# Altium schematic sheet PCI_Express.SchDoc
size A3; PageSetup: Record=PageOptions|CenterHorizontal=True|CenterVertical=True|PrintScale=0.73|XCorrection=1.00|YCorrection=1.00|PrintKind=0|BorderSize=5000000|LeftOffset=0|BottomOffset=0|Orientation=2|PaperLength=1000|PaperWidth=1000|Scale=100|PaperSource=7|PrintQuality=-4|MediaType=1|DitherType=10|PaperKind=A4|PrintScaleMode=1; Date: 27.05.2014; DrawnBy: luths8; Organization: BFH; Address1: Bern University of Applied Sciences; Address2: Engineering and Information Technology; Address3: Jlcoweg 1; Address4: CH-3400 Burgdorf; DocumentNumber: 13; Revision: 1.0; SheetNumber: 13; SheetTotal: 16; CurrentDate: 27.05.2014
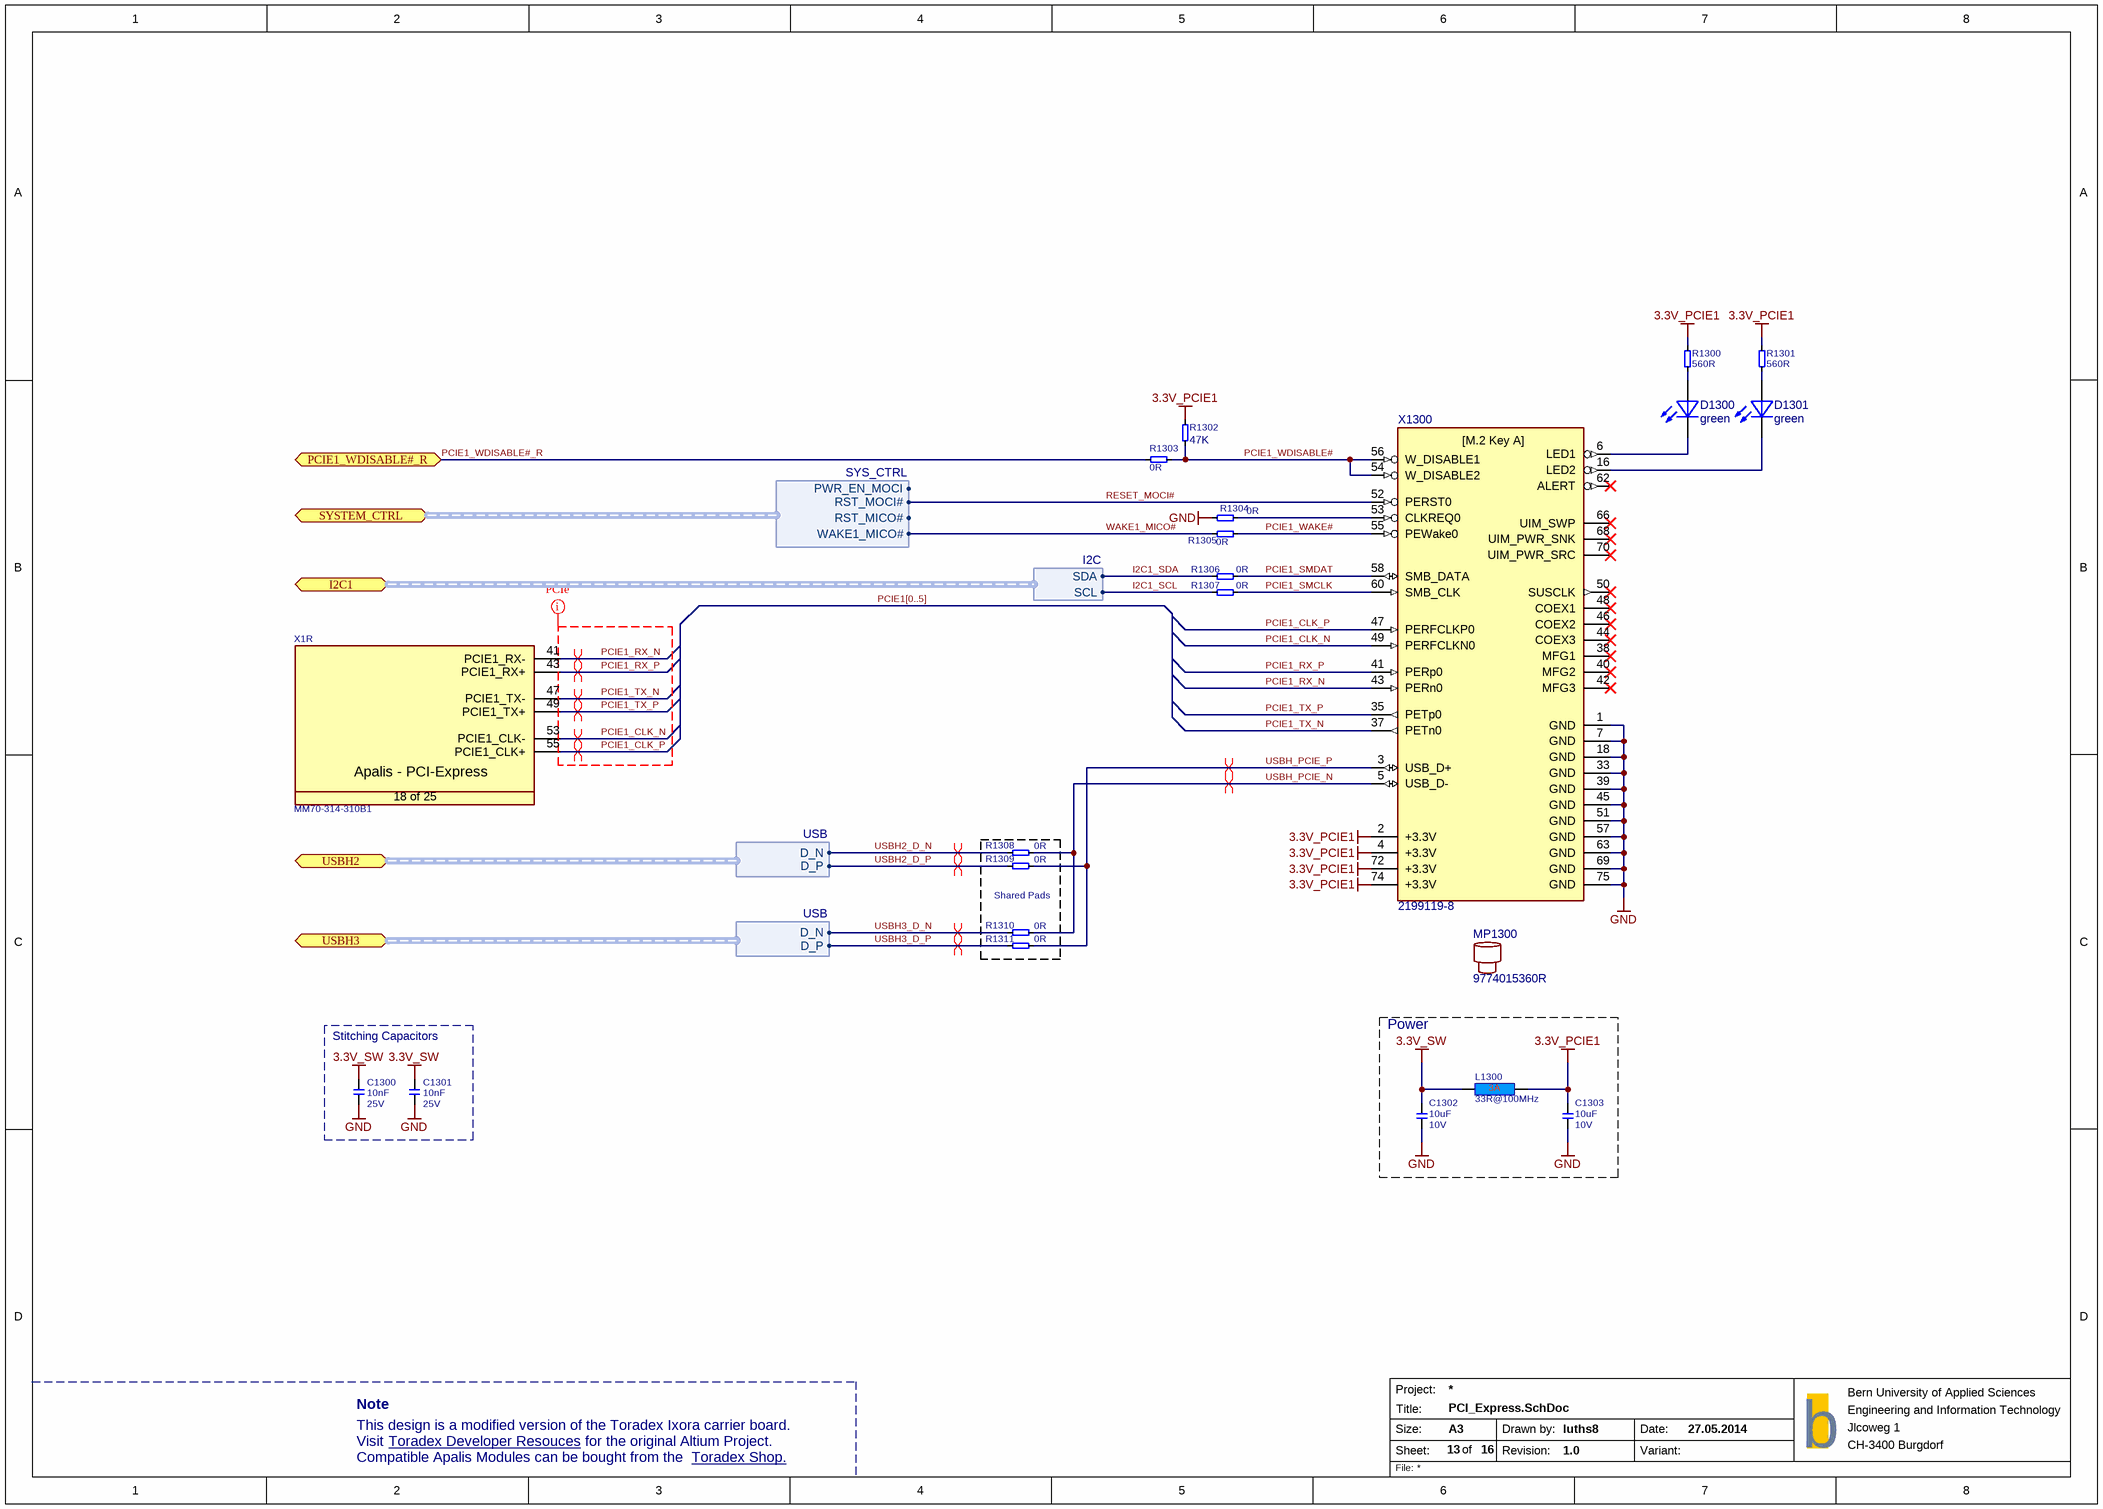
[diagram p0: PCI_Express.SchDoc]

## Parts
C1300  10nF  Rating: 25V  [SMD0603CAP]
C1301  10nF  Rating: 25V  [SMD0603CAP]
C1302  Rating: 10V  [SMD0603CAP]  (hidden comment: 10uF)
C1303  Rating: 10V  [SMD0603CAP]  (hidden comment: 10uF)
D1300  green  [LED]
D1301  green  [LED]
L1300  33R@100MHz  [INDC1608X95N]
MP1300  9774015360R
R1300  560R  [SMD0603RES]
R1301  560R  [SMD0603RES]
R1302  47K  [SMD0603RES]
R1303  0R  [SMD0603RES]
R1304  0R  [SMD0603RES]
R1305  0R  [SMD0603RES]
R1306  0R  [SMD0603RES]
R1307  0R  [SMD0603RES]
R1308  0R  [SMD0603RES]
R1309  0R  [SMD0603RES]
R1310  0R  [SMD0603RES]
R1311  0R  [SMD0603RES]
X1  Manufacturer Part No.: MM70-314-310B1  [T_JAE_MM70-314-310B1]  (hidden comment: CON-JAE-MM70-314-310B1-314-0.5mm)  (part R of 25)
X1300  2199119-8  [2199119-8-KEY-A-2230]

## Blocks framed on the sheet
Shared Pads: R1308-R1311
Stitching Capacitors: C1300 C1301
Power: C1302 C1303 L1300

## Ports
I2C1 (bidir, harness I2C, see 12, 17, 19, 5), PCIE1_WDISABLE#_R (bidir, see 19), SYSTEM_CTRL (bidir, harness SYS_CTRL, see 12, 19, 4), USBH2 (bidir, harness USB, see 6, 7), USBH3 (bidir, harness USB, see 6, 7)

## Harnesses
USB: D_N, D_P
I2C: SCL, SDA
SYS_CTRL: PWR_EN_MOCI, RST_MOCI#, RST_MICO#, WAKE1_MICO#

## Nets
3.3V_PCIE1: C1303.2 L1300.2 R1300.1 R1301.1 R1302.2 X1300.2(+3.3V) X1300.4(+3.3V) X1300.72(+3.3V) X1300.74(+3.3V)
3.3V_SW: C1300.2 C1301.2 C1302.2 L1300.1
GND: C1300.1 C1301.1 C1302.1 C1303.1 R1304.1 X1300.1(GND) X1300.7(GND) X1300.18(GND) X1300.33(GND) X1300.39(GND) X1300.45(GND) X1300.51(GND) X1300.57(GND) X1300.63(GND) X1300.69(GND) X1300.75(GND)
I2C1_SCL: R1307.1 ; port I2C1.SCL
I2C1_SDA: R1306.1 ; port I2C1.SDA
PCIE1_CLK_N: X1.53(PCIE1_CLK-) X1300.49(PERFCLKN0)
PCIE1_CLK_P: X1.55(PCIE1_CLK+) X1300.47(PERFCLKP0)
PCIE1_RX_N: X1.41(PCIE1_RX-) X1300.43(PERn0)
PCIE1_RX_P: X1.43(PCIE1_RX+) X1300.41(PERp0)
PCIE1_SMCLK: R1307.2 X1300.60(SMB_CLK)
PCIE1_SMDAT: R1306.2 X1300.58(SMB_DATA)
PCIE1_TX_N: X1.47(PCIE1_TX-) X1300.37(PETn0)
PCIE1_TX_P: X1.49(PCIE1_TX+) X1300.35(PETp0)
PCIE1_WAKE#: R1305.2 X1300.55(PEWake0)
PCIE1_WDISABLE#: R1302.1 R1303.1 X1300.54(W_DISABLE2) X1300.56(W_DISABLE1)
PCIE1_WDISABLE#_R: R1303.2 ; port PCIE1_WDISABLE#_R
RESET_MOCI#: X1300.52(PERST0) ; port SYSTEM_CTRL.RST_MOCI#
USBH2_D_N: R1308.1 ; port USBH2.D_N
USBH2_D_P: R1309.1 ; port USBH2.D_P
USBH3_D_N: R1310.1 ; port USBH3.D_N
USBH3_D_P: R1311.1 ; port USBH3.D_P
USBH_PCIE_N: R1308.2 R1310.2 X1300.5(USB_D-)
USBH_PCIE_P: R1309.2 R1311.2 X1300.3(USB_D+)
WAKE1_MICO#: R1305.1 ; port SYSTEM_CTRL.WAKE1_MICO#
NetD1300_A: D1300.A R1300.2
NetD1300_C: D1300.C X1300.6(LED1)
NetD1301_A: D1301.A R1301.2
NetD1301_C: D1301.C X1300.16(LED2)
NetR1304_2: R1304.2 X1300.53(CLKREQ0)

Not connected (* = marked no-connect by the designer): X1300 38(MFG1)* 40(MFG2)* 42(MFG3)* 44(COEX3)* 46(COEX2)* 48(COEX1)* 50(SUSCLK)* 62(ALERT)* 66(UIM_SWP)* 68(UIM_PWR_SNK)* 70(UIM_PWR_SRC)*

## Buses and harness runs
bus PCIE1[0..5]

## Layout directives
differential pair: PCIE1_CLK_N, PCIE1_CLK_P, PCIE1_RX_N, PCIE1_RX_P, PCIE1_TX_N, PCIE1_TX_P, USBH2_D_N, USBH2_D_P, USBH3_D_N, USBH3_D_P, USBH_PCIE_N, USBH_PCIE_P
net class PCIe: PCIE1_CLK_N, PCIE1_CLK_P, PCIE1_RX_N, PCIE1_RX_P, PCIE1_TX_N, PCIE1_TX_P

## Notes on the sheet
- Note
- This design is a modified version of the Toradex Ixora carrier board.
- Visit
- Compatible Apalis Modules can be bought from the
- Toradex Developer Resouces <https://developer.toradex.com/products/ixora-carrier-board>
- for the original Altium Project.
- Toradex Shop. <https://www.toradex.com/order-now/apalis-arm-family>
- Project:
- Size:
- Sheet:
- Title:
- A3
- of
- Drawn by:
- Revision:
- Date:
- Variant:
- b
- File:
- (in symbol CON-JAE-MM70-314-310B1-314-0.5mm, part R) Apalis - PCI-Express; 18 of 25
- (in symbol Connector M.2 Key A) [M.2 Key A]

## Library data of the parts
C1300 C1301 = C-X7R-10nF-25V-10%-0603: Capacitor Ceramic X7R 10nF 25V 10% 0603; Tolerance: 10%; Type: X7R; Value: 10nF
C1302 C1303 = C-X5R-10uF-10V-20%-0603: Capacitor Ceramic X5R 10uF 10V 20% 0603; Tolerance: 20%; Type: X5R; Value: 10uF
D1300 D1301 = LED green: Manufacturer Part No.: LGM67KG1J224Z
L1300 = L-33R@100MHz-3A-25%-0603: 33R@100MHz 3A EMI FILTER; Tolerance: 25%; Rating: 3A; Value: 33R@100MHz
MP1300 = Spacer M3 SMD: Manufacturer Part No.: 9774015360R
R1300 R1301 = R-560R-63mW-5%-0402: Resistor 560 ohm 63mW 5% 0603; Rating: 63mW; Tolerance: 5%; Value: 560R
R1302 = R-47KR-63mW-5%-0603: Resistor 47 Kohm 63mW 5% 0603; Value: 47KR; Rating: 63mW; Tolerance: 5%
R1303-R1305 R1308-R1311 = R-0R-63mW-1%-0603: Resistor 0 ohm 63mW 1% 0603; Rating: 63mW; Tolerance: 1%; Value: 0R
R1306 R1307 = R-0R-63mW-1%-0402: Resistor 0 ohm 63mW 1% 0603; Rating: 63mW; Tolerance: 1%; Value: 0R
X1 = CON-JAE-MM70-314-310B1-314-0.5mm: MXM3 Connector; Manufacturer Name: JAE; No. of ways: 314
X1300 = Connector M.2 Key A: Manufacturer Part No.: 2199119-8